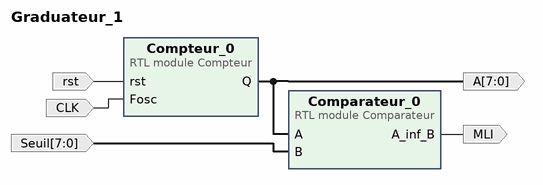
[diagram p0: block diagram of the top level]
# Vivado block design Graduateur_1, xc7z020clg484-1, Vivado 2019.1
create_bd_design Graduateur_1

create_bd_port -dir I -type rst rst
set_property -dict {CONFIG.POLARITY ACTIVE_HIGH} [get_bd_ports rst]
create_bd_port -dir I -type clk CLK
set_property -dict {CONFIG.FREQ_HZ 50000000} [get_bd_ports CLK]
create_bd_port -dir I -from 7 -to 0 Seuil
create_bd_port -dir O MLI
create_bd_port -dir O -from 7 -to 0 A

create_bd_cell -type module -reference Compteur Compteur_0
set_property -dict {CONFIG.N 8} [get_bd_cells Compteur_0]
create_bd_cell -type module -reference Comparateur Comparateur_0

# ---- connections ----

connect_bd_net [get_bd_pins Compteur_0/Q] [get_bd_pins Comparateur_0/A] [get_bd_ports A]
connect_bd_net [get_bd_ports rst] [get_bd_pins Compteur_0/rst]
connect_bd_net [get_bd_ports CLK] [get_bd_pins Compteur_0/Fosc]
connect_bd_net [get_bd_ports Seuil] [get_bd_pins Comparateur_0/B]
connect_bd_net [get_bd_pins Comparateur_0/A_inf_B] [get_bd_ports MLI]

set_property USER_COMMENTS.comment_0 {Projet Gradateur} [get_bd_cells /MLI]

validate_bd_design
save_bd_design
